# Altium schematic sheet DPAdapter.SchDoc
size A; SheetNumber: 1; SheetTotal: 1
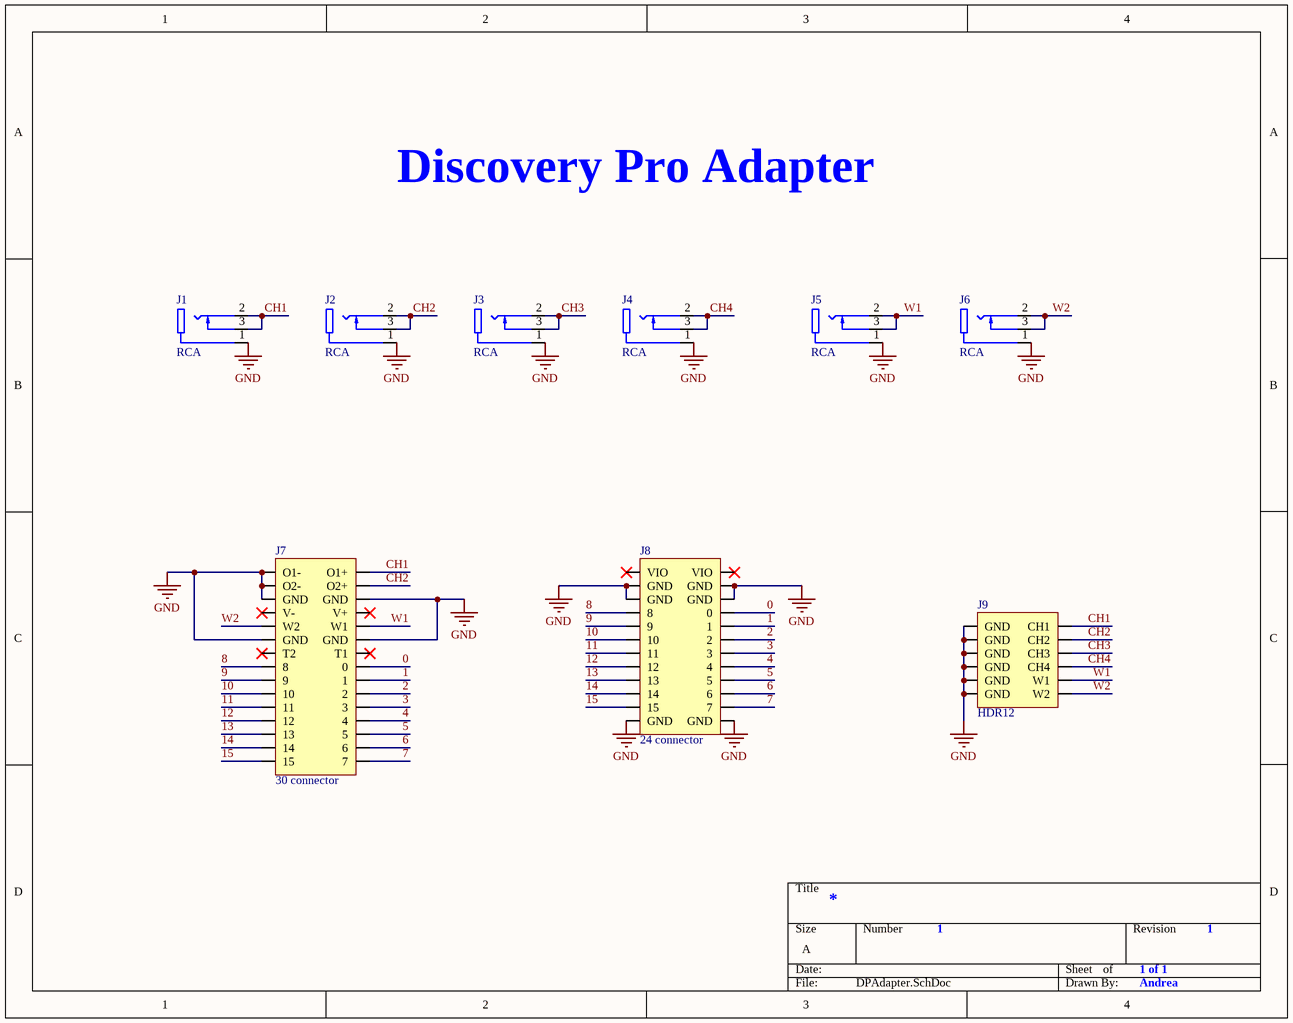
[diagram p0: DPAdapter.SchDoc]

## Parts
J1  RCA  [PJRAN1X1U]
J2  RCA  [PJRAN1X1U]
J3  RCA  [PJRAN1X1U]
J4  RCA  [PJRAN1X1U]
J5  RCA  [PJRAN1X1U]
J6  RCA  [PJRAN1X1U]
J7  30 connector  [AWHW_30_254]
J8  24 connector  [AWHW_24_254]
J9  HDR12  [HDR12_2.54]

## Nets
GND: J1.1(SLEEVE) J2.1(SLEEVE) J3.1(SLEEVE) J4.1(SLEEVE) J5.1(SLEEVE) J6.1(SLEEVE) J7.3(GND) J7.6(GND) J7.16(O1-) J7.17(O2-) J7.18(GND) J7.21(GND) J8.2(GND) J8.3(GND) J8.12(GND) J8.14(GND) J8.15(GND) J8.24(GND) J9.7(GND) J9.8(GND) J9.9(GND) J9.10(GND) J9.11(GND) J9.12(GND)
0: J7.8(0) J8.4(0)
1: J7.9(1) J8.5(1)
2: J7.10(2) J8.6(2)
3: J7.11(3) J8.7(3)
4: J7.12(4) J8.8(4)
5: J7.13(5) J8.9(5)
6: J7.14(6) J8.10(6)
7: J7.15(7) J8.11(7)
8: J7.23(8) J8.16(8)
9: J7.24(9) J8.17(9)
10: J7.25(10) J8.18(10)
11: J7.26(11) J8.19(11)
12: J7.27(12) J8.20(12)
13: J7.28(13) J8.21(13)
14: J7.29(14) J8.22(14)
15: J7.30(15) J8.23(15)
CH1: J1.2(TIP) J1.3(SHUNT) J7.1(O1+) J9.1(CH1)
CH2: J2.2(TIP) J2.3(SHUNT) J7.2(O2+) J9.2(CH2)
CH3: J3.2(TIP) J3.3(SHUNT) J9.3(CH3)
CH4: J4.2(TIP) J4.3(SHUNT) J9.4(CH4)
W1: J5.2(TIP) J5.3(SHUNT) J7.5(W1) J9.5(W1)
W2: J6.2(TIP) J6.3(SHUNT) J7.20(W2) J9.6(W2)

Not connected (* = marked no-connect by the designer): J7 4(V+)* 7(T1)* 19(V-)* 22(T2)*; J8 1(VIO)* 13(VIO)*

## Notes on the sheet
- Discovery Pro Adapter
- 1
- 1 of 1
- Andrea

## Library data of the parts
J1-J6 = PJRAN1X1U04X: 3.20mm ID, 9.00mm OD (RCA) Phono (RCA) Jack Mono Connector Solder; MF: Switchcraft Inc.; Price: None; Value: *; Check_prices: https://www.snapeda.com/parts/PJRAN1X1U04X/Switchcraft%20Inc./view-part/64730/?ref=eda; Package: None; Availability: In Stock; MP: PJRAN1X1U04X; SnapEDA_Link: https://www.snapeda.com/parts/PJRAN1X1U04X/Switchcraft%20Inc./view-part/64730/?ref=snap
J7 = DIGILENT_RIBBON
J8 = DIGILENT_RIBBON_SMALL
J9 = HDR_12_2.54